# EAGLE design quadcopter_cape_v3 (EAGLE 6.5.0)
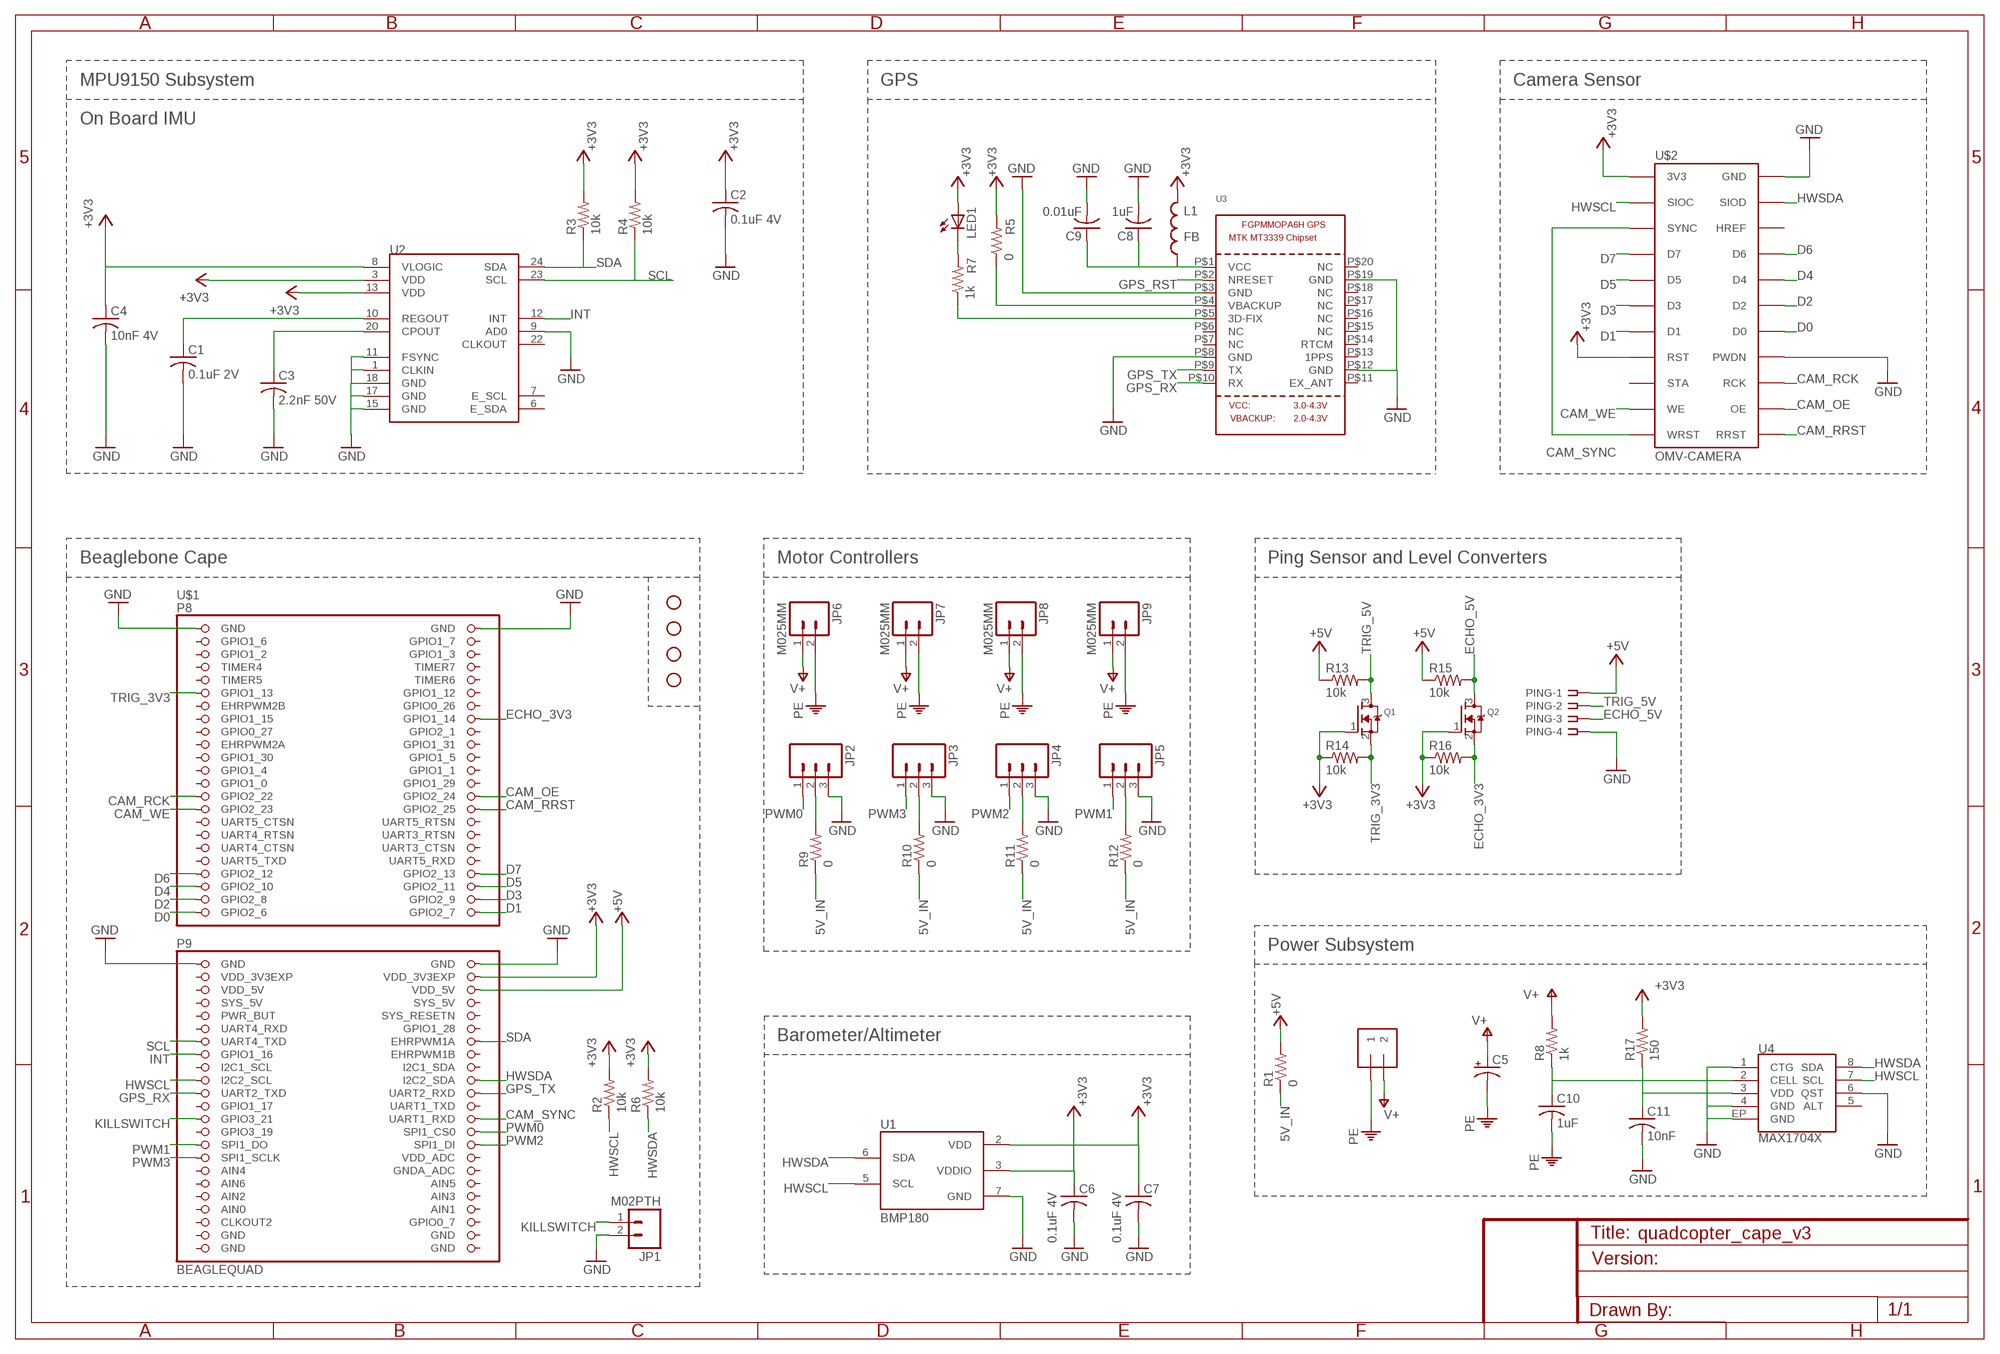
[diagram p0: schematic, sheet 1]

## Parts
C1  0.1uF 2V  C-USC0805  [C0805]
C2  0.1uF 4V  C-USC0805  [C0805]
C3  2.2nF 50V  C-USC0805  [C0805]
C4  10nF 4V  C-USC0805  [C0805]
C5  10UF-25V-20%(PTH)  [CPOL-RADIAL-10UF-25V]
C6  0.1uF 4V  C-USC0805  [C0805]
C7  0.1uF 4V  C-USC0805  [C0805]
C8  1uF  C-USC0805  [C0805]
C9  0.01uF  C-USC0805  [C0805]
C10  1uF  C-USC0805  [C0805]
C11  10nF  C-USC0805  [C0805]
JP1  M02PTH  [1X02]
JP2  M03PTH  [1X03]
JP3  M03PTH  [1X03]
JP4  M03PTH  [1X03]
JP5  M03PTH  [1X03]
JP6  M025MM  [SCREWTERMINAL-5MM-2]
JP7  M025MM  [SCREWTERMINAL-5MM-2]
JP8  M025MM  [SCREWTERMINAL-5MM-2]
JP9  M025MM  [SCREWTERMINAL-5MM-2]
L1  FB  INDUCTOR0805  [0805]
LED1  LEDCHIP-LED0805  [CHIP-LED0805]
PING  SSW-104-02-S-S-RA  [SSW-104-02-S-S-RA]
Q1  MOSFET-NREFLOW  [SOT23]
Q2  MOSFET-NREFLOW  [SOT23]
R1  0  R-US_M0805  [M0805]
R2  10k  R-US_M0805  [M0805]
R3  10k  R-US_M0805  [M0805]
R4  10k  R-US_M0805  [M0805]
R5  0  R-US_M0805  [M0805]
R6  10k  R-US_M0805  [M0805]
R7  1k  R-US_M0805  [M0805]
R8  1k  R-US_M0805  [M0805]
R9  0  R-US_M0805  [M0805]
R10  0  R-US_M0805  [M0805]
R11  0  R-US_M0805  [M0805]
R12  0  R-US_M0805  [M0805]
R13  10k  R-US_M0805  [M0805]
R14  10k  R-US_M0805  [M0805]
R15  10k  R-US_M0805  [M0805]
R16  10k  R-US_M0805  [M0805]
R17  150  R-US_M0805  [M0805]
STANDOFF1  STAND-OFF  [STAND-OFF]
STANDOFF2  STAND-OFF  [STAND-OFF]
STANDOFF3  STAND-OFF  [STAND-OFF]
STANDOFF4  STAND-OFF  [STAND-OFF]
U1  BMP180  [BMP180]
U2  MPU-9150QFN-24-NP  [QFN-24-NP]
U3  GPS_FGPMMOPA6H  [FGPMMOPA6H]
U4  MAX1704X  [TDFN-8]
U$1  BEAGLEQUAD  [BEAGLEQUAD_SHIELD]
U$2  OMV-CAMERA  [OMV-CAMERA]
U$3  1X2-12AWG  [1X2-12AWG]

## Nets
5V_IN: R1.1 R9.1 R10.1 R11.1 R12.1
+3V3: C2.1 C4.1 C6.1 C7.1 L1.2 LED1.A Q1.1(G) Q2.1(G) R2.2 R3.2 R4.2 R5.2 R6.2 R14.1 R16.1 R17.2 U1.2(VDD) U1.3(VDDIO) U2.3(VDD) U2.8(VLOGIC) U2.13(VDD) U$1.50(VDD_3V3EXP) U$2.3V3 U$2.RST
+5V: PING.1 R1.2 R13.1 R15.1 U$1.52(VDD_5V)
CAM_OE: U$1.28(GPIO2_24) U$2.OE
CAM_RCK: U$1.27(GPIO2_22) U$2.RCK
CAM_RRST: U$1.30(GPIO2_25) U$2.RRST
CAM_SYNC: U$1.72(UART1_RXD) U$2.SYNC U$2.WRST
CAM_WE: U$1.29(GPIO2_23) U$2.WE
D0: U$1.45(GPIO2_6) U$2.D0
D1: U$1.46(GPIO2_7) U$2.D1
D2: U$1.43(GPIO2_8) U$2.D2
D3: U$1.44(GPIO2_9) U$2.D3
D4: U$1.41(GPIO2_10) U$2.D4
D5: U$1.42(GPIO2_11) U$2.D5
D6: U$1.39(GPIO2_12) U$2.D6
D7: U$1.40(GPIO2_13) U$2.D7
ECHO_3V3: Q2.2(S) R16.2 U$1.16(GPIO1_14)
ECHO_5V: PING.3 Q2.3(D) R15.2
GND: C1.2 C2.2 C3.2 C4.2 C6.2 C7.2 C8.2 C9.2 C11.2 JP1.2 JP2.3 JP3.3 JP4.3 JP5.3 PING.4 U1.7(GND) U2.1(CLKIN) U2.9(AD0) U2.11(FSYNC) U2.15(GND) U2.17(GND) U2.18(GND) U3.P$3(GND) U3.P$8(GND) U3.P$12(GND) U3.P$19(GND) U4.1(CTG) U4.4(GND) U4.6(QST) U4.EP(GND) U$1.1(GND) U$1.2(GND) U$1.47(GND) U$1.48(GND) U$2.GND U$2.PWDN
GPS_RST: U3.P$2(NRESET)
GPS_RX: U3.P$10(RX) U$1.67(UART2_TXD)
GPS_TX: U3.P$9(TX) U$1.68(UART2_RXD)
HWSCL: R2.1 U1.5(SCL) U4.7(SCL) U$1.65(I2C2_SCL) U$2.SIOC
HWSDA: R6.1 U1.6(SDA) U4.8(SDA) U$1.66(I2C2_SDA) U$2.SIOD
INT: U2.12(INT) U$1.61(GPIO1_16)
KILLSWITCH: JP1.1 U$1.71(GPIO3_21)
N$1: C10.1 R8.1 U4.2(CELL)
N$2: C1.1 U2.10(REGOUT)
N$3: R5.1 U3.P$4(VBACKUP)
N$4: C3.1 U2.20(CPOUT)
N$5: R7.1 U3.P$5(3D-FIX)
N$6: LED1.C R7.2
N$7: C8.1 C9.1 L1.1 U3.P$1(VCC)
N$10: JP2.2 R9.2
N$11: JP3.2 R10.2
N$12: JP4.2 R11.2
N$13: JP5.2 R12.2
N$14: C11.1 R17.1 U4.3(VDD)
PE: C5.2(-) C10.2 JP6.2 JP7.2 JP8.2 JP9.2 U$3.P$1
PWM0: JP2.1 U$1.74(SPI1_CS0)
PWM1: JP5.1 U$1.75(SPI1_DO)
PWM2: JP4.1 U$1.76(SPI1_DI)
PWM3: JP3.1 U$1.77(SPI1_SCLK)
SCL: R4.1 U2.23(SCL) U$1.59(UART4_TXD)
SDA: R3.1 U2.24(SDA) U$1.60(EHRPWM1A)
TRIG_3V3: Q1.2(S) R14.2 U$1.11(GPIO1_13)
TRIG_5V: PING.2 Q1.3(D) R13.2
V+: C5.1(+) JP6.1 JP7.1 JP8.1 JP9.1 R8.2 U$3.P$2
Unconnected: U2.6(E_SDA) U2.7(E_SCL) U2.22(CLKOUT) U3.P$6(NC) U3.P$7(NC) U3.P$11(EX_ANT) U3.P$13(1PPS) U3.P$14(RTCM) U3.P$15(NC) U3.P$16(NC) U3.P$17(NC) U3.P$18(NC) U3.P$20(NC) U4.5(ALT) U$1.3(GPIO1_6) U$1.4(GPIO1_7) U$1.5(GPIO1_2) U$1.6(GPIO1_3) U$1.7(TIMER4) U$1.8(TIMER7) U$1.9(TIMER5) U$1.10(TIMER6) U$1.12(GPIO1_12) U$1.13(EHRPWM2B) U$1.14(GPIO0_26) U$1.15(GPIO1_15) U$1.17(GPIO0_27) U$1.18(GPIO2_1) U$1.19(EHRPWM2A) U$1.20(GPIO1_31) U$1.21(GPIO1_30) U$1.22(GPIO1_5) U$1.23(GPIO1_4) U$1.24(GPIO1_1) U$1.25(GPIO1_0) U$1.26(GPIO1_29) U$1.31(UART5_CTSN) U$1.32(UART5_RTSN) U$1.33(UART4_RTSN) U$1.34(UART3_RTSN) U$1.35(UART4_CTSN) U$1.36(UART3_CTSN) U$1.37(UART5_TXD) U$1.38(UART5_RXD) U$1.54(SYS_5V) U$1.55(PWR_BUT) U$1.56(SYS_RESETN) U$1.57(UART4_RXD) U$1.58(GPIO1_28) U$1.62(EHRPWM1B) U$1.63(I2C1_SCL) U$1.64(I2C1_SDA) U$1.69(GPIO1_17) U$1.70(UART1_TXD) U$1.73(GPIO3_19) U$1.78(VDD_ADC) U$1.79(AIN4) U$1.80(GNDA_ADC) U$1.81(AIN6) U$1.82(AIN5) U$1.83(AIN2) U$1.84(AIN3) U$1.86(AIN1) U$1.87(CLKOUT2) U$1.88(GPIO0_7) U$2.HREF U$2.STA

## Notes on the sheet
- MPU9150 Subsystem | GPS | Camera Sensor
- On Board IMU
- Beaglebone Cape | Motor Controllers | Ping Sensor and Level Converters
- Power Subsystem
- Barometer/Altimeter

## Power pins joined to a net without a drawn wire
AIN0: U$1.85(AIN0)
GND: U$1.89(GND) U$1.90(GND) U$1.91(GND) U$1.92(GND)
SYS_5V: U$1.53(SYS_5V)
VDD_3V3EXP: U$1.49(VDD_3V3EXP)
VDD_5V: U$1.51(VDD_5V)

## Library data of the parts
C1-C4 C6-C11 = resistor:C-US: CAPACITOR, American symbol
C5 = SparkFun-Capacitors:10UF-25V-20%(PTH): CAP-08440; PROD_ID: CAP-08440
JP1 JP6-JP9 = SparkFun-Connectors:M02: Standard 2-pin 0.1" header. Use with - straight break away headers ( PRT-00116) - right angle break away headers (PRT-00553) - swiss pins (PRT-00743) - machine pins (PRT-00117) - female headers (PRT-00115) Molex polarized connector foot print use with: PRT-08233 with associated crimp pins and housings. 2.54_SCREWTERM for use with PRT-10571. 3.5mm Screw Terminal footprints for PRT-08084 5mm Screw Terminal footprints for use with PRT-08433
JP2-JP5 = SparkFun-Connectors:M03: Header 3 Standard 3-pin 0.1" header. Use with straight break away headers (SKU : PRT-00116), right angle break away headers (PRT-00553), swiss pins (PRT-00743), machine pins (PRT-00117), and female headers (PRT-00115). Molex polarized connector foot print use with SKU : PRT-08232 with associated crimp pins and housings.
L1 = SparkFun-Passives:INDUCTOR: Inductors Basic Inductor/Choke - 0603 and 1206. Footprints are not proven and vary greatly between part numbers. SRN6045- 33uH, 20% 1.4A SDR0403-560KL - 56uH, 10%, 500mA RMS/740mA peak
LED1 = led:LED: LED OSRAM: - CHIPLED LG R971, LG N971, LY N971, LG Q971, LY Q971, LO R971, LY R971 LH N974, LH R974 LS Q976, LO Q976, LY Q976 LO Q996 - Hyper CHIPLED LW Q18S LB Q993, LB Q99A, LB R99A - SideLED LS A670, LO A670, LY A670, LG A670, LP A670 LB A673, LV A673, LT A673, LW A673 LH A674 LY A675 LS A676, LA A676, LO A676, LY A676, LW A676 LS A679, LY A679, LG A679 - Hyper Micro SIDELED® LS Y876, LA Y876, LO Y876, LY Y876 LT Y87S - SmartLED LW L88C, LW L88S LB L89C, LB L89S, LG L890 LS L89K, LO L89K, LY L89K LS L896, LA L896, LO L896, LY L896 - TOPLED LS T670, LO T670, LY T670, LG T670, LP T670 LSG T670, LSP T670, LSY T670, LOP T670, LYG T670 LG T671, LOG T671, LSG T671 LB T673, LV T673, LT T673, LW T673 LH T674 LS T676, LA T676, LO T676, LY T676, LB T676, LH T676, LSB T676, LW T676 LB T67C, LV T67C, LT T67C, LS T67K, LO T67K, LY T67K, LW E67C LS E67B, LA E67B, LO E67B, LY E67B, LB E67C, LV E67C, LT E67C LW T67C LS T679, LY T679, LG T679 LS T770, LO T770, LY T770, LG T770, LP T770 LB T773, LV T773, LT T773, LW T773 LH T774 LS E675, LA E675, LY E675, LS T675 LS T776, LA T776, LO T776, LY T776, LB T776 LHGB T686 LT T68C, LB T68C - Hyper Mini TOPLED® LB M676 - Mini TOPLED Santana® LG M470 LS M47K, LO M47K, LY M47K Source: http://www.osram.convergy.de LUXEON: - LUMILED® LXK2-PW12-R00, LXK2-PW12-S00, LXK2-PW14-U00, LXK2-PW14-V00 LXK2-PM12-R00, LXK2-PM12-S00, LXK2-PM14-U00 LXK2-PE12-Q00, LXK2-PE12-R00, LXK2-PE12-S00, LXK2-PE14-T00, LXK2-PE14-U00 LXK2-PB12-K00, LXK2-PB12-L00, LXK2-PB12-M00, LXK2-PB14-N00, LXK2-PB14-P00, LXK2-PB14-Q00 LXK2-PR12-L00, LXK2-PR12-M00, LXK2-PR14-Q00, LXK2-PR14-R00 LXK2-PD12-Q00, LXK2-PD12-R00, LXK2-PD12-S00 LXK2-PH12-R00, LXK2-PH12-S00 LXK2-PL12-P00, LXK2-PL12-Q00, LXK2-PL12-R00 Source: www.luxeon.com KINGBRIGHT: KA-3528ASYC Source: www.kingbright.com
PING = con-samtec:SSW-104-02-S-S: THROUGH-HOLE .025" SQ POST SOCKET Source: Samtec SSW.pdf; MPN: SSW-104-02-S-S-RA; OC_FARNELL: unknown; OC_NEWARK: 11P9385
Q1 Q2 = adafruit:MOSFET-N: N-Channel Mosfet 2N7002E - 60V 260mA SOT23 [Digikey: 2N7002ET1GOSTR-ND] - REEL BSH103 - 30V 850mA SOT23 [Digikey: 568-5013-1-ND]
R1-R17 = resistor:R-US_: RESISTOR, American symbol
STANDOFF1-STANDOFF4 = SparkFun-Electromechanical:STAND-OFF: #4 Stand Off This is the mechanical footprint for a #4 phillips button head screw. Use the keepout ring to avoid running the screw head into surrounding components. SKU : PRT-00447
U1 = SparkFun-Sensors:BMP180: BOSCH BMP180 DIGITAL BAROMETRIC PRESSURE SENSOR Web page: http://www.bosch-sensortec.com/en/homepage/products_3/environmental_sensors_1/bmp180_1/bmp180 Datasheet: http://ae-bst.resource.bosch.com/media/products/dokumente/bmp180/BST-BMP180-DS000-09.pdf The BMP180 is the function compatible successor of the BMP085, a new generation of high precision digital pressure sensors for consumer applications. The ultra-low power, low voltage electronics of the BMP180 is optimized for use in mobile phones, PDAs, GPS navigation devices and outdoor equipment. With a low altitude noise of merely 0.25m at fast conversion time, the BMP180 offers superior performance. The I2C interface allows for easy system integration with a microcontroller. The BMP180 is based on piezo-resistive technology for EMC robustness, high accuracy and linearity as well as long term stability. Key features: - Temperature measurement included - I2C interface - Fully calibrated - Pb-free, halogen-free and RoHS compliant, - MSL 1 Basic specs: Pressure range: 300 to 1100hPa (+9000m to -500m relating to sea level) Supply voltage: 1.8 to 3.6V (VDD), 1.62V to 3.6V (VDDIO) Package: LGA package with metal lid Small footprint: 3.6mm x 3.8mm Super-flat: 0.93mm height Low power: 5μA at 1 sample / sec. in standard mode Low noise: 0.06hPa (0.5m) in ultra low power mode, 0.02hPa (0.17m) advanced resolution mode Typical applications: - Enhancement of GPS navigation (dead-reckoning, slope detection, etc.) - In- and out-door navigation - Leisure and sports - Weather forecast - Vertical velocity indication (rise/sink speed)
U2 = SparkFun-Sensors:MPU-9150: 9DOF (3mag, 3accel, 3rotat). I2C interface.
U3 = adafruit:GPS_FGPMMOPA6H: GPS Module - MTK MT3339 Chipset, -165dBm sensitivity, 22 channels, 10Hz, auto-select external antenna options
U4 = SparkFun-PowerIC:MAX1704X: MAX17043/MAX17044: Battery Fuel Guage (43 is 1cell, 44 is 2cell)
U$1 = adafruit:BEAGLEQUAD: Beaglebone Black Quadcopter Cape V2.0
U$2 = adafruit:OMV-CAMERA
U$3 = adafruit:1X2-12AWG

## Board
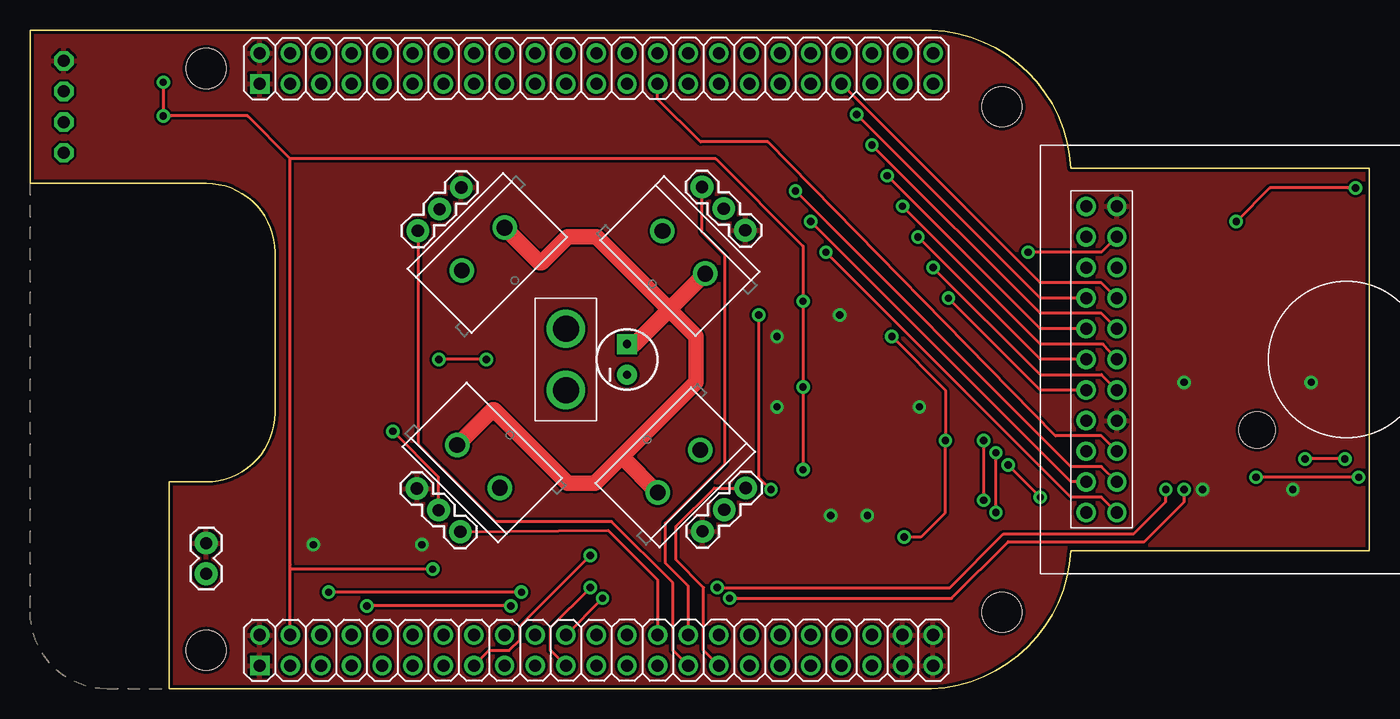
[diagram p1: board, top side]
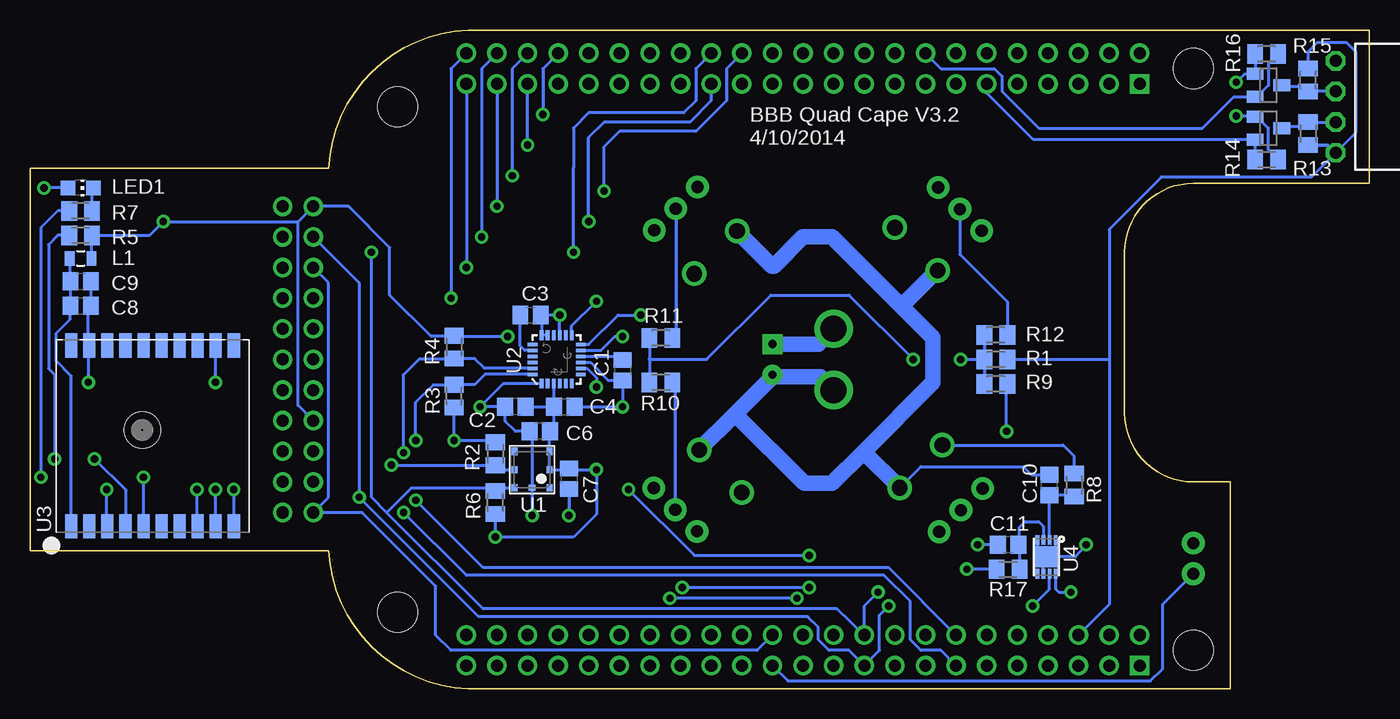
[diagram p2: board, bottom side, seen from below]

Size 111.12 x 54.62 mm. Coordinates in mm from the lower left corner, seen from the top.
Copper layers (1*16): Top 0.035mm / dielectric 1.5mm / Bottom 0.035mm
Design rules "SparkFun *": minimum track width 8mil, minimum drill 20mil, track to track 8mil, track to pad 8mil, pad to pad 8mil, via to via 8mil, smd to smd 8mil, copper to edge 10mil, drill to drill 8mil, minimum pad ring 12mil, minimum via ring 10mil, stop-mask expansion 4mil, vias tented up to drill 25mil, thermal gap 10mil

### Footprints (pad centres in the part's own frame; a part is rotated, then mirrored left to right if it is on the bottom)
C0805 = smd 1.3 x 1.5: 1 -0.85,0; 2 0.85,0
CPOL-RADIAL-10UF-25V = drill 0.7 pad 1.651 square: 1 1.27,0 | drill 0.7 pad 1.651: 2 -1.27,0
1X02 = drill 1.016 pad 1.88: 1 0,0; 2 2.54,0
1X03 = drill 1.016 pad 1.88: 1 0,0; 2 2.54,0; 3 5.08,0
SCREWTERMINAL-5MM-2 = drill 1.3 pad 2.032: 1 0,0; 2 5,0
0805 = smd 0.8 x 1.2: 1 -0.9,0; 2 0.9,0
CHIP-LED0805 = smd 1.2 x 1.2: A 0,-1.05; C 0,1.05
SSW-104-02-S-S-RA = drill 1 pad 1.5 octagon: 1 -3.81,1.524; 2 -1.27,1.524; 3 1.27,1.524; 4 3.81,1.524
SOT23 = smd 1 x 1.4: 1 -0.95,-1.1; 2 0.95,-1.1; 3 0,1.1
M0805 = smd 1.3 x 1.6: 1 -0.95,0; 2 0.95,0
STAND-OFF = hole 3.302: 0,0
BMP180 = smd 0.6 x 0.5: 1 1.5,1.45; 2 0,1.45; 3 -1.5,1.45; 4 -1.5,-1.45; 5 0,-1.45; 6 1.5,-1.45 | smd 0.5 x 0.6: 7 1.5,0
QFN-24-NP = smd 0.8 x 0.3: 1 -2,1.25; 2 -2,0.75; 3 -2,0.25; 4 -2,-0.25; 5 -2,-0.75; 6 -2,-1.25; 13 2,-1.25; 14 2,-0.75; 15 2,-0.25; 16 2,0.25; 17 2,0.75; 18 2,1.25 | smd 0.3 x 0.8: 7 -1.25,-2; 8 -0.75,-2; 9 -0.25,-2; 10 0.25,-2; 11 0.75,-2; 12 1.25,-2; 19 1.25,2; 20 0.75,2; 21 0.25,2; 22 -0.25,2; 23 -0.75,2; 24 -1.25,2
FGPMMOPA6H = smd 2 x 1: P$1 -7.5,6.75; P$2 -7.5,5.25; P$3 -7.5,3.75; P$4 -7.5,2.25; P$5 -7.5,0.75; P$6 -7.5,-0.75; P$7 -7.5,-2.25; P$8 -7.5,-3.75; P$9 -7.5,-5.25; P$10 -7.5,-6.75; P$11 7.5,-6.75; P$12 7.5,-5.25; P$13 7.5,-3.75; P$14 7.5,-2.25; P$15 7.5,-0.75; P$16 7.5,0.75; P$17 7.5,2.25; P$18 7.5,3.75; P$19 7.5,5.25; P$20 7.5,6.75 | hole 3: 0.5,0.85
TDFN-8 = smd 0.8 x 0.3: 1 -1.4,0.75; 2 -1.4,0.25; 3 -1.4,-0.25; 4 -1.4,-0.75; 5 1.4,-0.75; 6 1.4,-0.25; 7 1.4,0.25; 8 1.4,0.75 | smd 1.73 x 1.88: EP 0,0
BEAGLEQUAD_SHIELD = drill 1 square: 1 4.445,19.05; 47 52.705,19.05 | drill 1: 2 1.905,19.05; 3 4.445,21.59; 4 1.905,21.59; 5 4.445,24.13; 6 1.905,24.13; 7 4.445,26.67; 8 1.905,26.67; 9 4.445,29.21; 10 1.905,29.21; 11 4.445,31.75; 12 1.905,31.75; 13 4.445,34.29; 14 1.905,34.29; 15 4.445,36.83; 16 1.905,36.83; 17 4.445,39.37; 18 1.905,39.37; 19 4.445,41.91; 20 1.905,41.91; 21 4.445,44.45; 22 1.905,44.45; 23 4.445,46.99; 24 1.905,46.99; 25 4.445,49.53; 26 1.905,49.53; 27 4.445,52.07; 28 1.905,52.07; 29 4.445,54.61; 30 1.905,54.61; 31 4.445,57.15; 32 1.905,57.15; 33 4.445,59.69; 34 1.905,59.69; 35 4.445,62.23; 36 1.905,62.23; 37 4.445,64.77; 38 1.905,64.77; 39 4.445,67.31; 40 1.905,67.31; 41 4.445,69.85; 42 1.905,69.85; 43 4.445,72.39; 44 1.905,72.39; 45 4.445,74.93; 46 1.905,74.93; 48 50.165,19.05; 49 52.705,21.59; 50 50.165,21.59; 51 52.705,24.13; 52 50.165,24.13; 53 52.705,26.67; 54 50.165,26.67; 55 52.705,29.21; 56 50.165,29.21; 57 52.705,31.75; 58 50.165,31.75; 59 52.705,34.29; 60 50.165,34.29; 61 52.705,36.83; 62 50.165,36.83; 63 52.705,39.37; 64 50.165,39.37; 65 52.705,41.91; 66 50.165,41.91; 67 52.705,44.45; 68 50.165,44.45; 69 52.705,46.99; 70 50.165,46.99; 71 52.705,49.53; 72 50.165,49.53; 73 52.705,52.07; 74 50.165,52.07; 75 52.705,54.61; 76 50.165,54.61; 77 52.705,57.15; 78 50.165,57.15; 79 52.705,59.69; 80 50.165,59.69; 81 52.705,62.23; 82 50.165,62.23; 83 52.705,64.77; 84 50.165,64.77; 85 52.705,67.31; 86 50.165,67.31; 87 52.705,69.85; 88 50.165,69.85; 89 52.705,72.39; 90 50.165,72.39; 91 52.705,74.93; 92 50.165,74.93
OMV-CAMERA = drill 1: 3V3 -1.27,12.7; D0 1.27,-2.54; D1 -1.27,-2.54; D2 1.27,0; D3 -1.27,0; D4 1.27,2.54; D5 -1.27,2.54; D6 1.27,5.08; D7 -1.27,5.08; GND 1.27,12.7; HREF 1.27,7.62; OE 1.27,-10.16; PWDN 1.27,-5.08; RCK 1.27,-7.62; RRST 1.27,-12.7; RST -1.27,-5.08; SIOC -1.27,10.16; SIOD 1.27,10.16; STA -1.27,-7.62; SYNC -1.27,7.62; WE -1.27,-10.16; WRST -1.27,-12.7
1X2-12AWG = drill 2.159: P$1 0,0; P$2 0,5.08

### Placement (x,y rotation side)
C1  61.98,26.42 270 bottom
C2  70.87,23.38 180 bottom
C3  69.6,31 0 bottom
C4  66.8,23.38 0 bottom
C5  49.53,27.31 90 top
C6  68.83,21.34 180 bottom
C7  66.42,17.41 270 bottom
C8  106.93,31.76 0 bottom
C9  106.93,33.79 0 bottom
C10  26.54,16.9 90 bottom
C11  29.97,11.95 180 bottom
JP1  14.61,9.53 90 top
JP2  35.69,13.01 135 top
JP3  59.39,16.64 225 top
JP4  55.75,41.61 315 top
JP5  32.18,37.98 45 top
JP6  35.43,20.2 315 top
JP7  52.07,16.26 45 top
JP8  56.01,34.42 135 top
JP9  39.37,38.23 225 top
L1  106.93,35.69 0 bottom
LED1  106.93,41.54 270 bottom
PING  1.27,48.27 90 bottom
Q1  8.38,46.49 270 bottom
Q2  8.38,50.05 270 bottom
R1  30.99,27.31 0 bottom
R2  72.52,19.49 90 bottom
R3  75.95,24.26 270 bottom
R4  75.95,28.33 90 bottom
R5  106.93,37.6 0 bottom
R6  72.52,15.45 270 bottom
R7  106.93,39.63 0 bottom
R8  24.51,16.9 90 bottom
R9  30.99,25.28 0 bottom
R10  58.8,25.41 0 bottom
R11  58.8,29.09 0 bottom
R12  30.99,29.34 0 bottom
R13  5.08,46.04 90 bottom
R14  8.53,43.89 180 bottom
R15  5.08,50.49 270 bottom
R16  8.53,52.65 0 bottom
R17  29.97,9.91 180 bottom
STANDOFF1  14.61,3.18 0 top
STANDOFF2  80.64,6.36 0 top
STANDOFF3  80.64,48.27 0 top
STANDOFF4  14.61,51.44 0 top
U1  69.47,18.17 270 bottom
U2  67.44,27.31 90 bottom
U3  100.97,20.96 90 bottom
U4  26.8,10.93 270 bottom
U$1  0,54.62 270 top
U$2  88.9,27.31 0 top
U$3  44.45,24.77 0 top

### Tracks (layer width: path | path; a pad name or v marks a point on that pad's centre or on a via)
5V_IN  (via drill 0.6)
  Top 0.254: v37.85,27.31 v33.91,27.31
  Bottom 0.254: 59.75,27.37 59.69,27.31 | 59.69,27.31 54.99,27.31 49.66,32.65 43.18,32.65 v37.85,27.31 | R12.1 R1.1 | R1.1 R9.1 | v33.91,27.31 R1.1 | 59.69,27.31 59.75,27.38 | R11.1 59.75,27.38 | R10.1 59.75,27.31 59.75,27.38
+3V3  (via drill 0.6)
  Top 0.254: v71.5,29.22 75.95,24.77 v75.95,20.58 75.95,14.61 73.91,12.58 v72.52,12.58 | v11.05,50.3 v11.05,47.51 18.03,47.51 21.59,43.95 | v64.14,18.17 v64.14,25.03 v64.14,32.14 64.14,36.71 56.9,43.95 21.59,43.95 | U$1.50 21.59,9.91 | 21.59,43.95 21.59,10.29 21.59,9.91 | v109.98,41.54 102.87,41.54 v100.08,38.74 | v33.4,9.91 21.59,9.91
  Bottom 0.254: U$2.RST 88.9,23.5 88.9,38.74 | 88.9,38.74 U$2.3V3 84.71,40.01 81.28,36.58 81.28,32.65 77.85,29.22 76.01,29.22 | R16.1 Q2.1 | R14.1 8.38,44.69 8.38,46.49 9.33,47.44 Q1.1 9.48,47.51 v11.05,47.51 | U2.3 67.69,23.38 | 67.69,23.38 67.69,21.64 C6.1 68.02,21.31 U1.3 U1.2 66.51,18.17 C7.1 66.33,18.17 v64.14,18.17 64.14,14.49 66.04,12.58 v72.52,12.58 R6.2 | C4.1 67.69,23.38 | C2.1 67.69,23.38 | R2.2 72.66,20.58 v75.95,20.58 R3.2 | R4.2 76.01,29.22 | 76.01,29.22 v71.5,29.22 | Q2.1 9.54,50.93 | v11.05,50.3 10.35,51 Q2.1 | U2.8 64.91,26.56 64.14,25.79 v64.14,25.03 | U2.13 66.19,30.09 v64.14,32.14 | 88.9,38.74 v100.08,38.74 101.22,37.6 R5.2 106.03,37.55 L1.2 | LED1.A v109.98,41.54 | R17.2 v33.4,9.91
+5V  (via drill 0.6)
  Bottom 0.254: PING.1 3.43,45.09 | 3.43,45.09 R13.1 | R13.1 | R13.1 3.43,45.09 | 3.43,45.09 PING.1 | PING.1 4.83,42.43 17.27,42.43 21.59,38.11 21.59,27.31 | R15.1 5.08,52.84 4.32,53.6 1.91,53.6 1.14,52.84 1.14,46.11 PING.1 | 21.59,27.31 21.59,6.99 U$1.52 | R1.2 21.59,27.31
  other vias: 2.79,44.46
CAM_OE  (via drill 0.6)
  Top 0.254: U$2.OE 88.9,18.42 86.36,18.42 v63.5,41.28
  Bottom 0.254: U$1.28 53.34,51.44 53.34,48.78 55.88,46.24 62.23,46.24 63.5,44.97 v63.5,41.28
CAM_RCK
  Top 0.254: U$2.RCK 88.9,20.96 85.09,20.96 61.21,45.35 55.63,45.35 52.07,48.9 U$1.27
CAM_RRST  (via drill 0.6)
  Top 0.254: U$2.RRST 88.9,15.88 86.36,15.88 v66.04,36.2
  Bottom 0.254: U$1.30 55.88,51.44 55.88,48.78 56.9,47.76 64.77,47.76 66.04,46.49 66.04,43.31 66.04,43.19 v66.04,36.2
CAM_SYNC
  Bottom 0.254: U$2.SYNC 86.36,33.66 86.36,15.88 U$2.WRST 83.57,14.61 77.47,8.52 77.47,4.45 76.2,3.18 50.8,3.18 U$1.72
CAM_WE  (via drill 0.6)
  Top 0.254: U$2.WE 86.36,17.15 v64.77,38.74
  Bottom 0.254: U$1.29 54.61,48.78 56.39,47 63.5,47 64.77,45.73 v64.77,38.74
D0  (via drill 0.6)
  Top 0.254: U$2.D0 88.9,26.04 83.82,26.04 v74.93,34.93
  Bottom 0.254: U$1.45 v74.93,34.93
D1  (via drill 0.6)
  Top 0.254: U$2.D1 83.82,24.77 v76.2,32.39
  Bottom 0.254: U$1.46 76.2,51.44 v76.2,32.39
D2  (via drill 0.6)
  Top 0.254: U$2.D2 89.03,28.58 83.82,28.58 v72.39,40.01
  Bottom 0.254: U$1.43 v72.39,40.01
D3  (via drill 0.6)
  Top 0.254: U$2.D3 83.82,27.31 v73.66,37.47
  Bottom 0.254: U$1.44 73.66,51.44 v73.66,37.47
D4  (via drill 0.6)
  Top 0.254: U$2.D4 88.9,31.12 83.82,31.12 v69.85,45.09
  Bottom 0.254: v69.85,45.09 U$1.41
D5  (via drill 0.6)
  Top 0.254: U$2.D5 83.82,29.85 v71.12,42.55
  Bottom 0.254: U$1.42 71.12,51.44 v71.12,42.55
D6
  Top 0.254: U$2.D6 88.9,33.66 83.82,33.66 U$1.39
D7  (via drill 0.6)
  Top 0.254: U$2.D7 83.82,32.39 v68.58,47.63
  Bottom 0.254: U$1.40 68.58,51.44 v68.58,47.63
ECHO_3V3
  Bottom 0.254: R16.2 8.38,51.85 8.38,50.05 9.33,49.1 Q2.2 11.24,49.1 13.84,46.49 27.43,46.49 30.48,49.54 30.48,50.81 31.11,51.44 35.56,51.44 U$1.16
ECHO_5V
  Bottom 0.254: PING.3 R15.2 5.46,49.92 6.86,49.92 6.99,50.05 Q2.3
GND  (via drill 0.6)
  Bottom 0.254: v69.47,14.36 U1.7 69.47,21.13 C6.2 70.87,21.34 71.72,22.19 C2.2 v73.79,23.38 71.88,25.28 68.72,25.28 U2.1 | C7.2 v66.42,14.36 | C4.2 v61.98,23.38 C1.2 63.16,25.57 64.64,27.06 U2.9 | U2.15 v67.19,30.99 | v67.19,30.99 v67.18,31 | U2.17 U2.18 68.69,30.8 C3.2 67.19,31 v67.19,30.99 | U2.11 63.77,28.06 62.61,29.22 v61.98,29.22 | U3.P$8 97.28,13.53 v97.28,16.52 | U3.P$12 95.76,28.42 v95.76,25.41 | v106.3,25.41 106.3,28.38 U3.P$19 106.3,28.46 106.3,31.76 C8.2 C9.2 | U3.P$3 104.78,13.52 v104.78,16.52 | U4.6 27.05,10.93 U4.EP | U4.EP 27.55,10.93 U4.4 27.55,11.07 27.56,11.06 | U4.1 26.05,10.93 U4.EP | C11.2 v32.51,11.95 | v23.5,11.95 24.38,10.93 U4.EP
  pour Top: 0,54.62 119.38,54.62 119.38,9.66 119.38,0.01 0,0.01
GPS_RX  (via drill 0.6)
  Top 0.254: U$1.67 43.18,3.18 43.18,5.09 v46.48,8.39 | v57.02,8.39 76.33,8.39 80.77,12.83 91.57,12.83 94.23,15.5 v94.23,16.52
  Bottom 0.254: v46.48,8.39 v57.02,8.39 | v94.23,16.52 94.23,13.46 U3.P$10
GPS_TX  (via drill 0.6)
  Top 0.254: U$1.68 v47.5,7.5 | v58.04,7.5 76.45,7.5 81.15,12.2 92.46,12.2 95.76,15.5 v95.76,16.52
  Bottom 0.254: v47.5,7.5 v58.04,7.5 | v95.76,16.52 95.76,13.51 U3.P$9
HWSCL  (via drill 0.6)
  Top 0.254: v83.82,15.88 v81.15,18.55 | v39.88,6.87 v27.94,6.87
  Bottom 0.254: U$2.SIOC 83.82,33.66 v83.82,15.88 73.91,5.98 46.61,5.98 45.72,5.09 45.72,4.07 44.83,3.18 43.18,3.18 U$1.65 40.64,3.18 40.64,6.1 v39.88,6.87 | U1.5 72.15,18.17 R2.1 v81.14,18.54 v81.15,18.55 | v27.94,6.87 26.55,8.26 U4.7
HWSDA  (via drill 0.6)
  Top 0.254: U$2.SIOD 88.9,36.2 v82.8,36.2 | v40.77,8.01 v24.77,8.01
  Bottom 0.254: U1.6 72.25,16.67 R6.1 72.77,16.65 79.49,16.65 81.53,14.61 | 81.53,14.61 73.53,6.61 44.2,6.61 U$1.66 41.91,6.87 v40.77,8.01 | 81.53,14.61 82.8,15.88 v82.8,36.2 | U4.8 26.05,8.27 25.78,8.01 v24.77,8.01
INT  (via drill 0.6)
  Top 0.254: U$1.61 38.1,3.18 39.75,3.18 40.64,4.07 40.64,5.21 v46.48,11.06 | v60.45,31 60.45,17.53 v61.47,16.52
  Bottom 0.254: v61.47,16.52 56.01,11.06 v46.48,11.06 | U2.12 64.79,28.56 62.36,31 v60.45,31
KILLSWITCH
  Bottom 0.254: U$1.71 48.26,0.64 18.16,0.64 17.14,1.66 17.14,6.99 JP1.1
N$1
  Bottom 0.254: R8.1 24.61,16.05 C10.1 U4.2
N$2
  Bottom 0.254: U2.10 62.27,27.56 C1.1
N$3  (via drill 0.6)
  Top 0.254: v109.09,19.06 v105.79,19.06
  Bottom 0.254: R5.1 108.84,37.6 109.6,36.84 109.6,26.55 109.09,26.04 v109.09,19.06 | v105.79,19.06 103.22,16.48 U3.P$4
N$4
  Bottom 0.254: U2.20 70.09,28.06 70.48,28.46 70.48,30.96 C3.1
N$5  (via drill 0.6)
  Top 0.254: v110.24,17.53 v101.73,17.53
  Bottom 0.254: R7.1 108.84,39.63 110.24,38.23 v110.24,17.53 | v101.73,17.53 101.73,13.47 U3.P$5
N$6
  Bottom 0.254: R7.2 105.98,41.44 LED1.C
N$7
  Bottom 0.254: L1.1 107.78,35.69 C9.1 C8.1 107.78,30.65 108.97,29.47 108.97,27.19 107.72,25.93 U3.P$1
N$8  (via drill 0.6)
  other vias: 79.12,20.58
N$9  (via drill 0.6)
  other vias: 79.12,15.63
N$10  (via drill 0.6)
  Top 0.254: JP2.2 33.89,17.55 v30.1,21.34
  Bottom 0.254: v30.1,21.34 30.1,25.28 R9.2
N$11
  Bottom 0.254: JP3.2 57.59,25.15 R10.2
N$12
  Bottom 0.254: JP4.2 57.55,29.77 R11.2
N$13
  Bottom 0.254: JP5.2 33.98,36.02 30.04,32.08 R12.2
N$14
  Bottom 0.254: C11.1 29.02,11.95 | 29.02,11.95 R17.1 | 29.02,11.95 29.02,13.4 28.57,13.85 27.43,13.85 27.05,13.47 U4.3
PE
  Bottom 0.254: JP6.2 37.21,18.42 28.7,18.42 28.03,17.75 C10.2
  Bottom 1.27: JP9.2 38.73,31.8 38.73,31.76 38.86,31.76 | 38.86,31.76 44.58,37.47 46.99,37.47 49.4,35.06 49.57,35.06 JP8.2 | 41.97,19.63 44.58,17.03 46.86,17.03 52.58,22.74 52.66,22.74 | 41.97,19.63 36.2,25.41 36.2,29.09 38.86,31.76 | 38.86,31.76 38.86,31.88 | JP6.2 41.93,19.63 41.97,19.63 | JP7.2 52.66,22.74 | C5.2 49.53,25.87 | 49.53,25.87 52.66,22.74 | 49.53,25.87 45.55,25.87 U$3.P$1
PWM0
  Top 0.254: U$1.74 52.07,9.02 47.95,13.14 JP2.1
PWM1
  Top 0.254: U$1.75 53.34,3.18 53.34,8.77 48.26,13.85 38.61,13.85 34.48,17.98 33.91,18.55 32.18,20.28 JP5.1
PWM2
  Top 0.254: U$1.76 54.61,8.52 52.7,10.42 52.7,13.72 57.66,18.68 57.66,35.95 55.75,37.85 JP4.1
PWM3
  Top 0.254: U$1.77 55.88,3.18 55.88,8.39 53.59,10.68 53.59,13.47 56.77,16.64 JP3.1
SCL  (via drill 0.6)
  Top 0.254: v80.14,14.61 v80.14,19.57
  Bottom 0.254: U2.23 73.42,26.56 74.23,27.38 R4.1 78.8,27.38 80.14,26.04 v80.14,19.57 | U$1.59 35.56,3.18 37.21,3.18 38.1,4.07 38.1,7.25 40.26,9.41 74.93,9.41 v80.14,14.61
SDA  (via drill 0.6)
  Top 0.254: v79.12,15.63 v79.12,20.58
  Bottom 0.254: U2.24 73.39,26.06 74.23,25.21 R3.1 77.66,25.21 79.12,23.76 v79.12,20.58 | U$1.60 39.88,10.04 73.53,10.04 v79.12,15.63
TRIG_3V3
  Bottom 0.254: R14.2 Q1.2 27.88,45.54 31.75,49.41 U$1.11
TRIG_5V
  Bottom 0.254: PING.2 R13.2 5.46,46.62 6.86,46.62 6.99,46.49 Q1.3
V+
  Top 1.27: 52.96,31.5 46.99,37.47 44.58,37.47 42.42,35.31 42.29,35.31 JP9.1 | 52.96,31.5 55.24,29.22 55.24,25.41 49.02,19.18 | 49.02,19.18 46.86,17.03 44.58,17.03 38.48,23.12 38.35,23.12 JP6.1 | JP8.1 53.09,31.5 | 53.09,31.5 52.96,31.5 | JP7.1 49.15,19.18 49.02,19.18 | C5.1 50.16,28.58 53.09,31.5
  Bottom 0.254: JP6.1 25.4,20.2 24.51,19.31 R8.2
  Bottom 1.27: C5.1 45.72,28.58 U$3.P$2

### Text on the board
bNames: BBB Quad Cape V3.2 | 4/10/2014 | U3